# EAGLE board DAC STM32 Board v5 - AD5391 (EAGLE 9.5.2), part 1 of 2
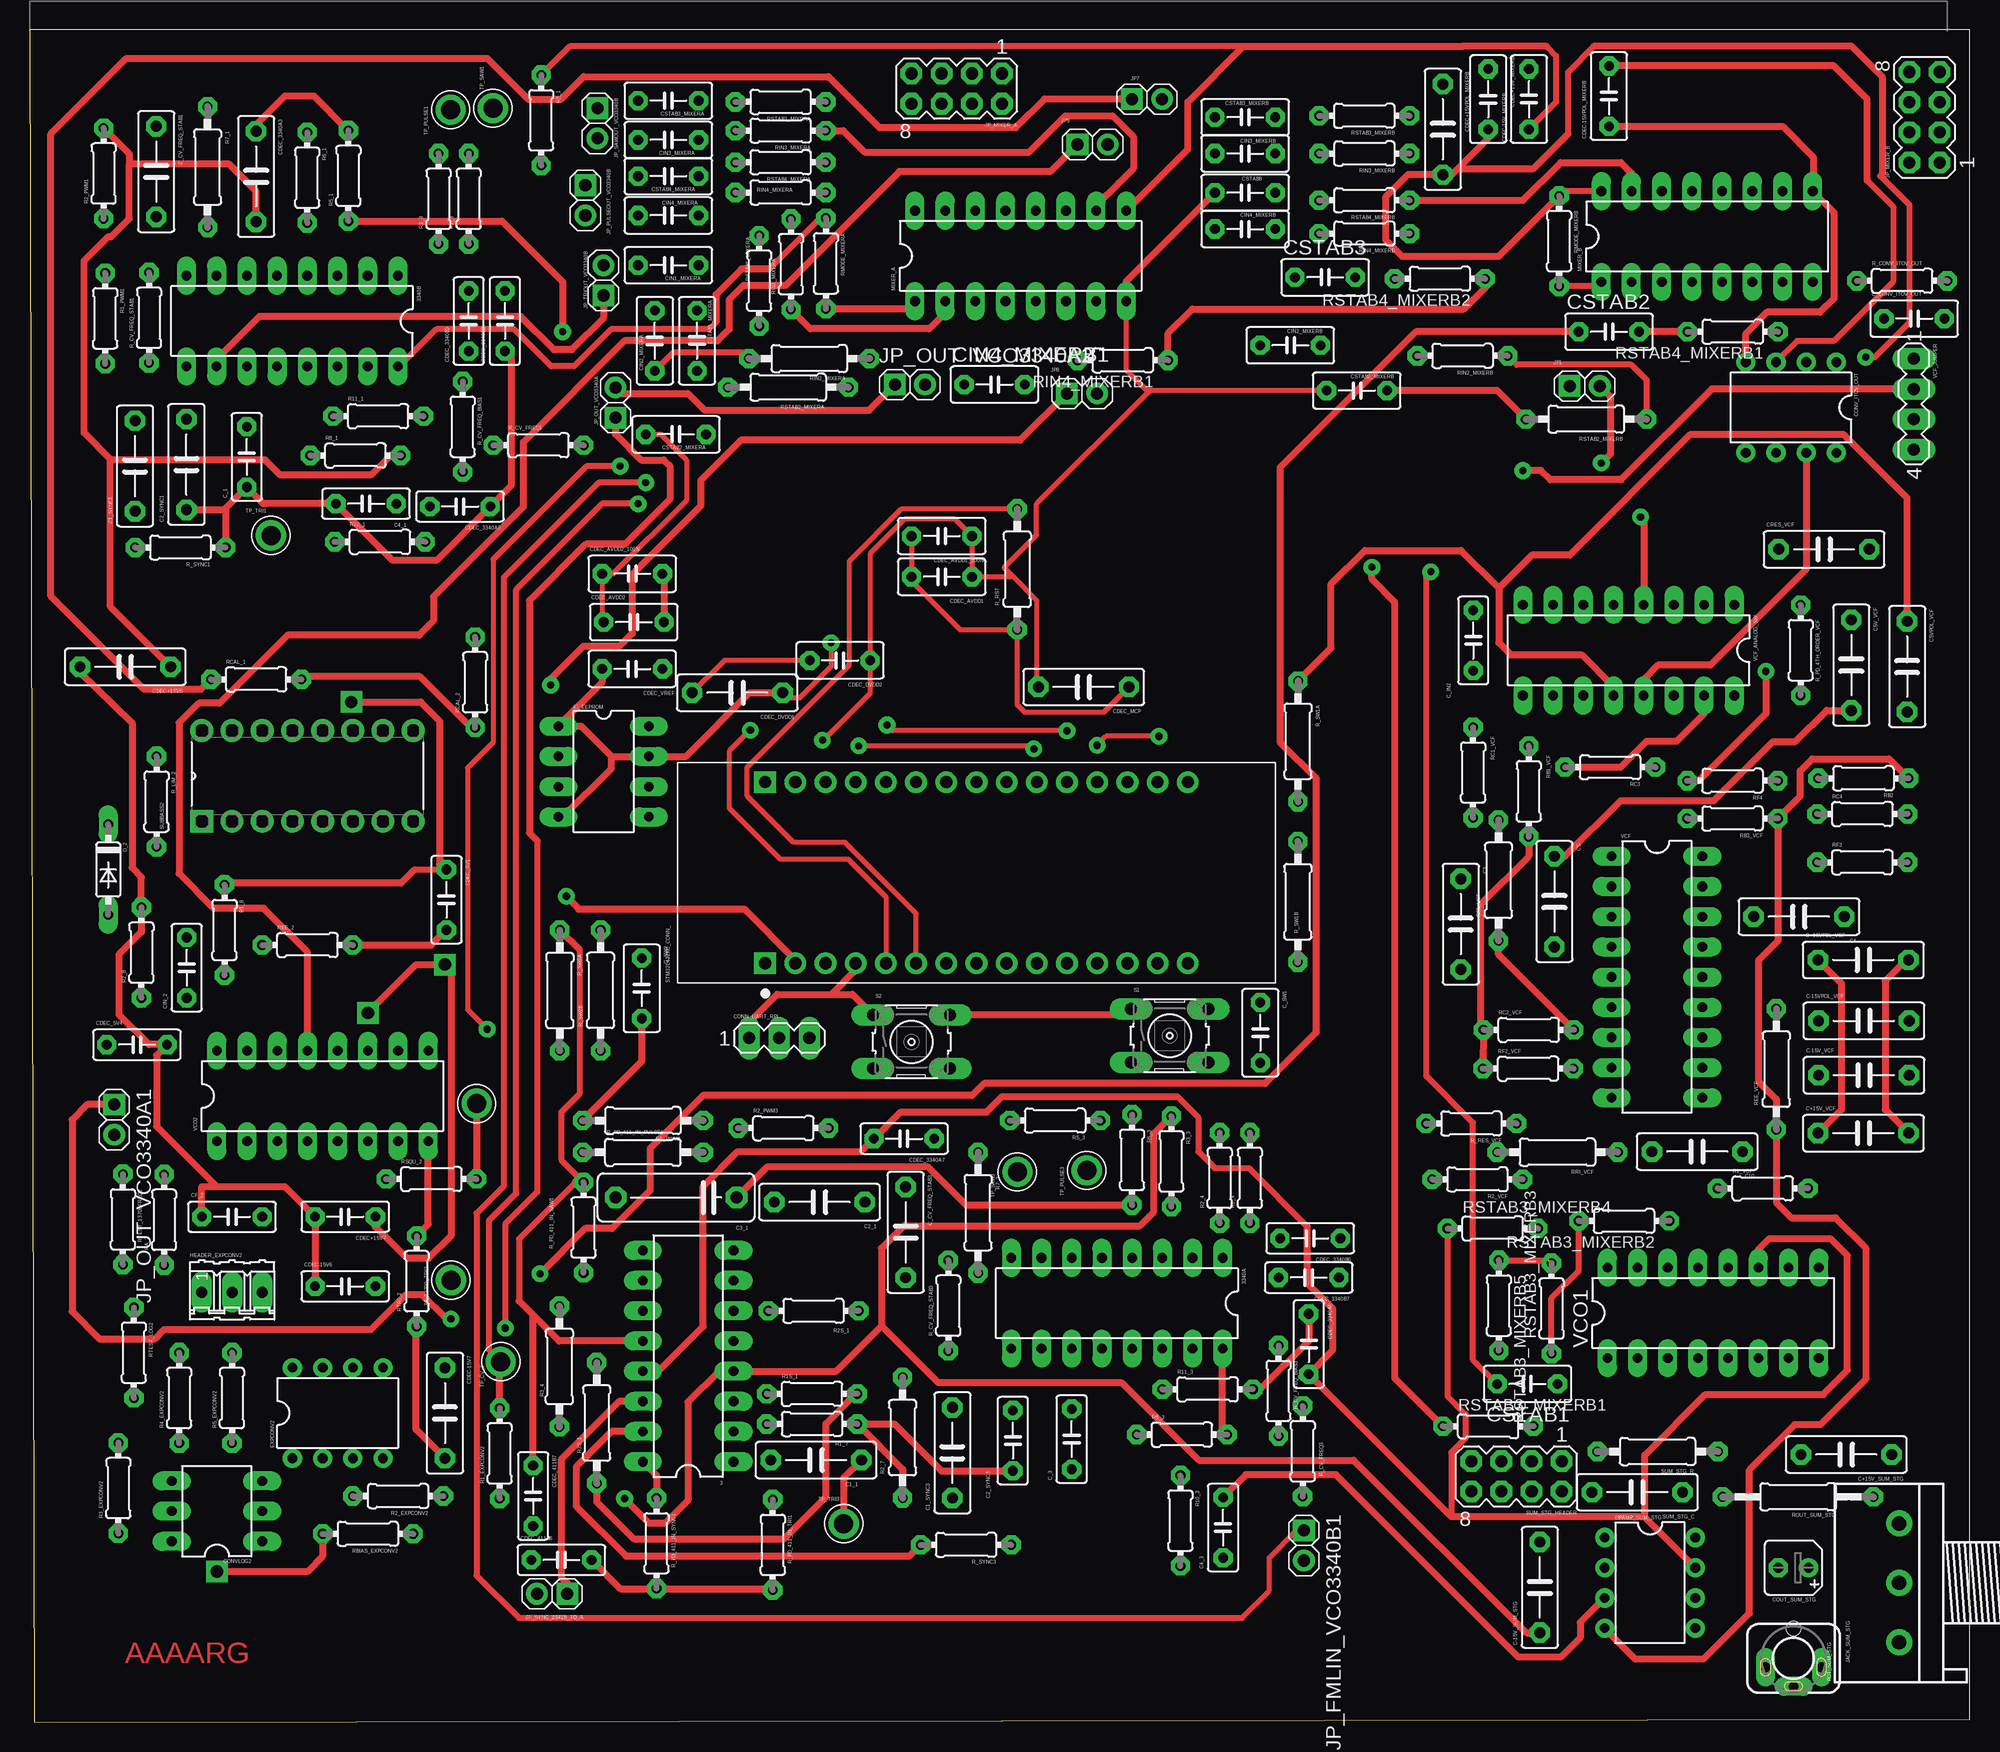
[diagram p6: board, top side]
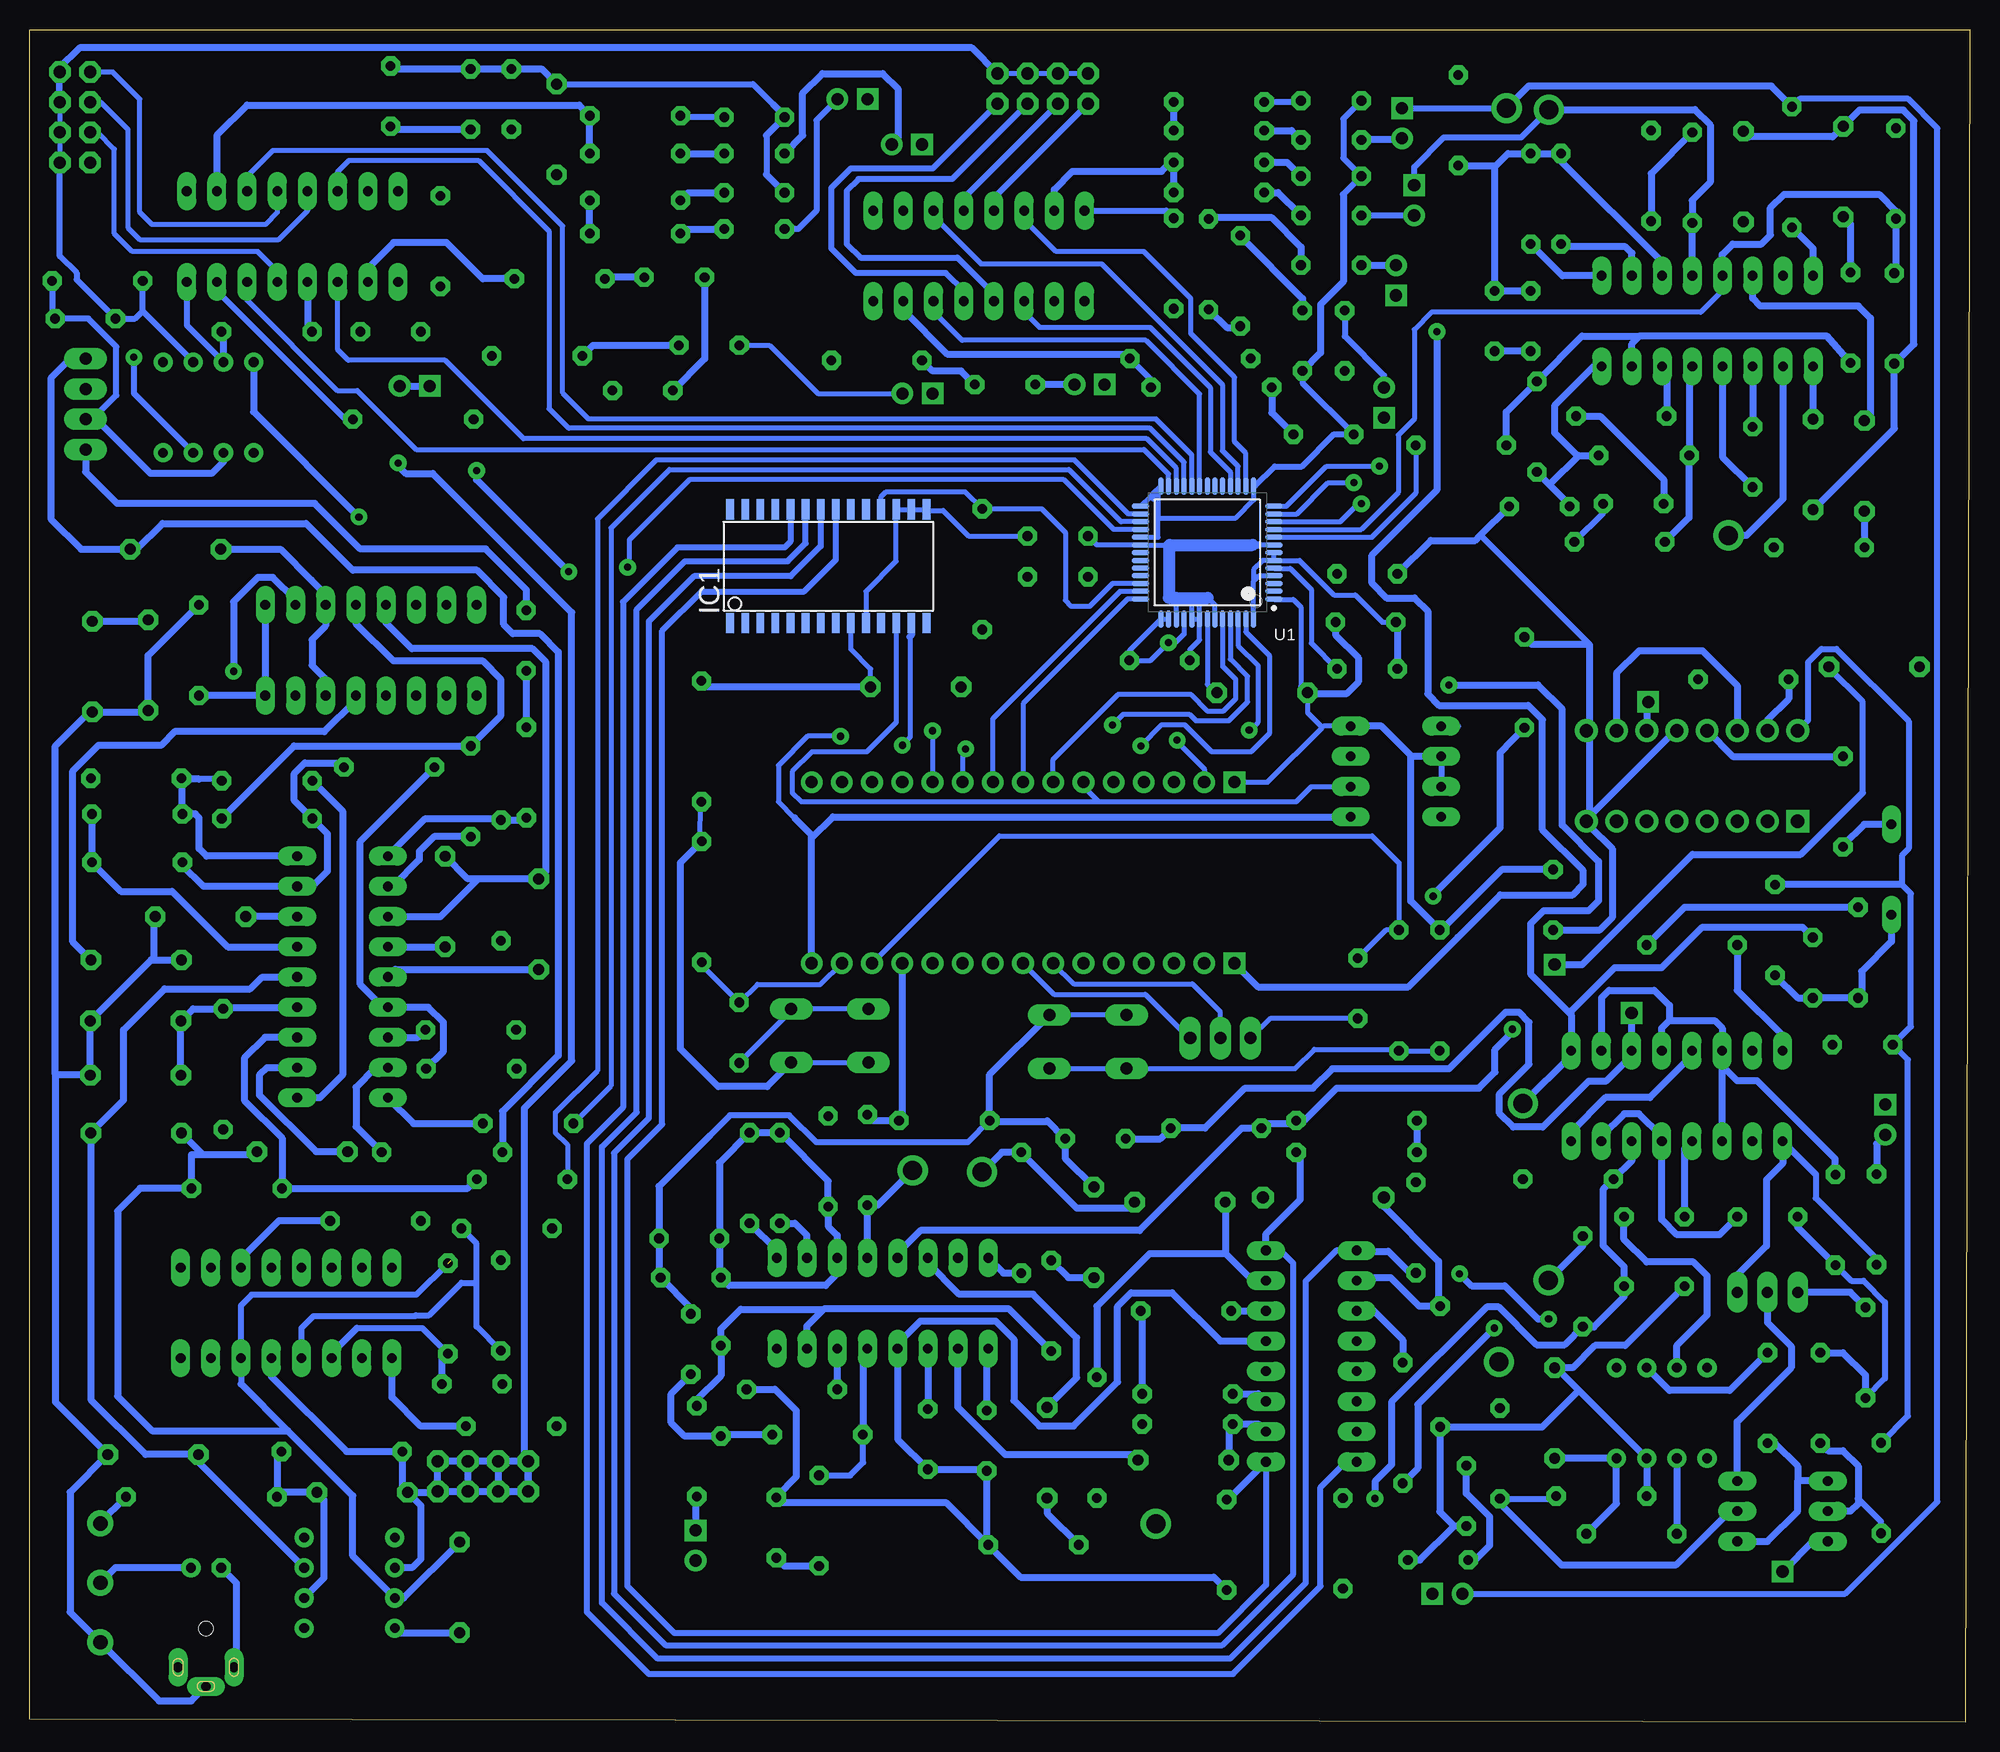
[diagram p7: board, bottom side, seen from below]

Size 163.19 x 142.37 mm. Coordinates in mm from the lower left corner, seen from the top.
Outline: 0.38,0 163.19,0.25 163.19,142.37 0,142.37 0.38,0
Copper layers (1*16): Top 0.035mm / dielectric 1.5mm / Bottom 0.035mm
Design rules "ENSEA_2019": minimum track width 0.4mm, minimum drill 0.6mm, track to track 0.4mm, track to pad 0.4mm, pad to pad 0.4mm, via to via 0.4mm, smd to smd 0.4mm, copper to edge 1mm, drill to drill 0.4mm, minimum pad ring 0.4mm, minimum via ring 0.4mm, stop-mask expansion 4mil, vias tented up to drill 0mil, thermal gap 0.4mm

## Footprints (pad centres in the part's own frame; a part is rotated, then mirrored left to right if it is on the bottom)
DIL16 = drill 0.813 long: 1 -8.89,-3.81; 2 -6.35,-3.81; 3 -3.81,-3.81; 4 -1.27,-3.81; 5 1.27,-3.81; 6 3.81,-3.81; 7 6.35,-3.81; 8 8.89,-3.81; 9 8.89,3.81; 10 6.35,3.81; 11 3.81,3.81; 12 1.27,3.81; 13 -1.27,3.81; 14 -3.81,3.81; 15 -6.35,3.81; 16 -8.89,3.81
C075-032X103 = drill 0.914 octagon: 1 -3.81,0; 2 3.81,0
C050-025X075 = drill 0.813 octagon: 1 -2.54,0; 2 2.54,0
C102-043X133 = drill 1.016 octagon: 1 -5.08,0; 2 5.08,0
C050-030X075 = drill 0.813 octagon: 1 -2.54,0; 2 2.54,0
MA03-1 = drill 1.016 long: 1 -2.54,0; 2 0,0; 3 2.54,0
DIL08 = drill 0.813 pad 1.27: 1 -3.81,-3.81; 2 -1.27,-3.81; 3 1.27,-3.81; 4 3.81,-3.81; 5 3.81,3.81; 6 1.27,3.81; 7 -1.27,3.81; 8 -3.81,3.81
DIL06 = drill 0.813 long: 1 -2.54,-3.81; 2 0,-3.81; 3 2.54,-3.81; 4 2.54,3.81; 5 0,3.81; 6 -2.54,3.81
B45181A = drill 0.813 pad 1.6: + -1.27,0 | drill 0.813 pad 1.6 octagon: - 1.27,0
DO35-7 = drill 0.813 long: A 3.81,0; C -3.81,0
03P = drill 0.914 long: 1 -2.54,0; 2 0,0; 3 2.54,0
SO28W = smd 0.65 x 1.7: 1 -7.62,-4.78; 2 -6.35,-4.78; 3 -5.08,-4.78; 4 -3.81,-4.78; 5 -2.54,-4.78; 6 -1.27,-4.78; 7 0,-4.78; 8 1.27,-4.78; 9 2.54,-4.78; 10 3.81,-4.78; 11 5.08,-4.78; 12 6.35,-4.78; 13 7.62,-4.78; 14 8.89,-4.78; 15 8.89,4.78; 16 7.62,4.78; 17 6.35,4.78; 18 5.08,4.78; 19 3.81,4.78; 20 2.54,4.78; 21 1.27,4.78; 22 0,4.78; 23 -1.27,4.78; 24 -2.54,4.78; 25 -3.81,4.78; 26 -5.08,4.78; 27 -6.35,4.78; 28 -7.62,4.78
DIL8 = drill 0.813 long: 1 -3.81,-3.81; 2 -1.27,-3.81; 3 1.27,-3.81; 4 3.81,-3.81; 5 3.81,3.81; 6 1.27,3.81; 7 -1.27,3.81; 8 -3.81,3.81
1502_01 = drill 0.8 pad 1.2 long: 1 0,2.35; 2 -2.35,0.75; 3 2.35,0.75 | hole 1.2: 0,-2.5
HDR2X1 = drill 1.016 square: 1 0,0 | drill 1.016: 2 2.54,0
MA04-2 = drill 1.016 octagon: 1 -3.81,-1.27; 2 -3.81,1.27; 3 -1.27,-1.27; 4 -1.27,1.27; 5 1.27,-1.27; 6 1.27,1.27; 7 3.81,-1.27; 8 3.81,1.27
3RP/1610N = drill 1.2 pad 2.184: 1 -5,0; 2 0,0; 3 5,0
0204/7 = drill 0.813 octagon: 1 -3.81,0; 2 3.81,0
0207/10 = drill 0.813 octagon: 1 -5.08,0; 2 5.08,0
0207/12 = drill 0.813 octagon: 1 -6.35,0; 2 6.35,0
B3F-10XX = drill 1.016 long: 1 -3.251,2.261; 2 3.251,2.261; 3 -3.251,-2.261; 4 3.251,-2.261
MODULE_NUCLEO-F303K8 = drill 1.02 square: 3.1 -7.62,17.78; 4.1 7.62,17.78 | drill 1.02: 3.2 -7.62,15.24; 3.3 -7.62,12.7; 3.4 -7.62,10.16; 3.5 -7.62,7.62; 3.6 -7.62,5.08; 3.7 -7.62,2.54; 3.8 -7.62,0; 3.9 -7.62,-2.54; 3.10 -7.62,-5.08; 3.11 -7.62,-7.62; 3.12 -7.62,-10.16; 3.13 -7.62,-12.7; 3.14 -7.62,-15.24; 3.15 -7.62,-17.78; 4.2 7.62,15.24; 4.3 7.62,12.7; 4.4 7.62,10.16; 4.5 7.62,7.62; 4.6 7.62,5.08; 4.7 7.62,2.54; 4.8 7.62,0; 4.9 7.62,-2.54; 4.10 7.62,-5.08; 4.11 7.62,-7.62; 4.12 7.62,-10.16; 4.13 7.62,-12.7; 4.14 7.62,-15.24; 4.15 7.62,-17.78
DIP254P762X420-16 = drill 1.118 square: 1 -7.62,17.78 | drill 1.118: 2 -7.62,15.24; 3 -7.62,12.7; 4 -7.62,10.16; 5 -7.62,7.62; 6 -7.62,5.08; 7 -7.62,2.54; 8 -7.62,0; 9 0,0; 10 0,2.54; 11 0,5.08; 12 0,7.62; 13 0,10.16; 14 0,12.7; 15 0,15.24; 16 0,17.78
TESTPOINT_63 = drill 1.6 pad 2.54: P$1 0,0
ANALOG_DEVICES_AD5391BSTZ-3_0 = smd 1.45 x 0.45: 1 -5.6,3.9; 2 -5.6,3.25; 3 -5.6,2.6; 4 -5.6,1.95; 5 -5.6,1.3; 6 -5.6,0.65; 7 -5.6,0; 8 -5.6,-0.65; 9 -5.6,-1.3; 10 -5.6,-1.95; 11 -5.6,-2.6; 12 -5.6,-3.25; 13 -5.6,-3.9; 27 5.6,-3.9; 28 5.6,-3.25; 29 5.6,-2.6; 30 5.6,-1.95; 31 5.6,-1.3; 32 5.6,-0.65; 33 5.6,0; 34 5.6,0.65; 35 5.6,1.3; 36 5.6,1.95; 37 5.6,2.6; 38 5.6,3.25; 39 5.6,3.9 | smd 0.45 x 1.45: 14 -3.9,-5.6; 15 -3.25,-5.6; 16 -2.6,-5.6; 17 -1.95,-5.6; 18 -1.3,-5.6; 19 -0.65,-5.6; 20 0,-5.6; 21 0.65,-5.6; 22 1.3,-5.6; 23 1.95,-5.6; 24 2.6,-5.6; 25 3.25,-5.6; 26 3.9,-5.6; 40 3.9,5.6; 41 3.25,5.6; 42 2.6,5.6; 43 1.95,5.6; 44 1.3,5.6; 45 0.65,5.6; 46 0,5.6; 47 -0.65,5.6; 48 -1.3,5.6; 49 -1.95,5.6; 50 -2.6,5.6; 51 -3.25,5.6; 52 -3.9,5.6
DIL18 = drill 0.813 long: 1 -10.16,-3.81; 2 -7.62,-3.81; 3 -5.08,-3.81; 4 -2.54,-3.81; 5 0,-3.81; 6 2.54,-3.81; 7 5.08,-3.81; 8 7.62,-3.81; 9 10.16,-3.81; 10 10.16,3.81; 11 7.62,3.81; 12 5.08,3.81; 13 2.54,3.81; 14 0,3.81; 15 -2.54,3.81; 16 -5.08,3.81; 17 -7.62,3.81; 18 -10.16,3.81
MA04-1 = drill 1.016 long: 1 -3.81,0; 2 -1.27,0; 3 1.27,0; 4 3.81,0

## Placement (x,y rotation side)
3  ADG411N  [DIL16]  55.39,30.79 90 top
3340A  CEM3340  [DIL16]  91.46,35.23 180 top
3340B  CEM3340  [DIL16]  22.07,117.86 180 top
C1_1  470n  [C075-032X103]  66.15,22.04 180 top
C1_SYNC1  1n  [C075-032X103]  8.86,105.67 90 top
C1_SYNC3  1n  [C075-032X103]  77.62,22.66 90 top
C2_1  470n  [C075-032X103]  66.44,43.74 180 top
C2_SYNC1  100n  [C075-032X103]  13.18,105.8 90 top
C2_SYNC3  100n  [C050-025X075]  82.7,23.68 90 top
C3  300p  [C075-032X103]  120.38,67.12 270 top
C3_1  470n  [C102-043X133]  54.38,44.12 180 top
C4  300p  [C075-032X103]  148.83,67.76 180 top
C4_1  10n  [C050-025X075]  28.29,102.49 180 top
C4_3  10n  [C050-025X075]  100.39,16.36 90 top
C5  300p  [C075-032X103]  128.25,69.03 270 top
C5V_VCF  100n  [C075-032X103]  153.23,88.92 270 top
C5VPOL_VCF  100n  [C075-032X103]  157.93,88.79 270 top
C10  300p  [C075-032X103]  140.27,47.99 180 top
C+15V_SUM_STG  100n  [C075-032X103]  152.81,22.51 180 top
C+15V_VCF  100n  [C075-032X103]  154.25,49.55 0 top
C+15VPOL_VCF  1u  [C075-032X103]  154.24,64.12 0 top
C-15V_SUM_STG  100n  [C075-032X103]  127.03,11.33 90 top
C-15V_VCF  100n  [C075-032X103]  154.29,54.42 0 top
C-15VPOL_VCF  1u  [C075-032X103]  154.29,59 0 top
C_1  1n  [C050-025X075]  18.26,106.43 90 top
C_3  1n  [C050-025X075]  87.65,23.8 90 top
C_CONV_ITOV_OUT  1p  [C050-030X075]  158.52,118.07 0 top
C_CV_FREQ_STAB1  10n  [C075-032X103]  10.64,130.43 270 top
C_CV_FREQ_STAB3  10n  [C075-032X103]  73.68,41.2 270 top
C_IN2  470n  [C050-025X075]  121.43,90.99 90 top
C_SW1  100n  [C050-030X075]  103.52,57.99 270 top
C_SW2  100n  [C050-030X075]  51.48,61.73 270 top
CDEC+15V6  100n  [C075-032X103]  8.04,88.77 180 top
CDEC+15V7  100n  [C050-025X075]  26.54,42.51 180 top
CDEC+15V_MIXERB  100n  [C050-030X075]  122.68,136.53 270 top
CDEC+15VPOL_MIXERB  100n  [C075-032X103]  118.87,133.98 270 top
CDEC-15V6  100n  [C050-025X075]  26.54,36.67 0 top
CDEC-15V7  100n  [C075-032X103]  34.92,26 270 top
CDEC-15V_MIXERB  100n  [C050-030X075]  126.11,136.53 90 top
CDEC-15VPOL_MIXERB  100n  [C050-030X075]  132.84,136.78 90 top
CDEC_5V1  100n  [C050-025X075]  35.05,69.18 270 top
CDEC_5V4  100n  [C050-025X075]  9.02,56.99 0 top
CDEC_411B6  100n  [C050-025X075]  44.72,13.64 0 top
CDEC_411B7  10u  [C050-025X075]  42.35,19.03 270 top
CDEC_3340A2  100n  [C050-025X075]  36.2,102.26 180 top
CDEC_3340A3  10u  [C075-032X103]  19.05,130.02 270 top
CDEC_3340A6  100n  [C050-025X075]  107.59,31.81 270 top
CDEC_3340A7  10u  [C050-025X075]  73.55,49.08 180 top
CDEC_3340B2  100n  [C050-025X075]  39.98,117.86 90 top
CDEC_3340B3  10u  [C050-025X075]  36.93,117.86 90 top
CDEC_3340B6  100n  [C050-025X075]  107.72,40.7 180 top
CDEC_3340B7  10u  [C050-025X075]  107.59,37.39 180 top
CDEC_AVDD1  10u  [C050-030X075]  76.72,96.35 180 top
CDEC_AVDD1_100N  100n  [C050-030X075]  76.72,99.78 180 top
CDEC_AVDD2  10u  [C050-030X075]  50.81,92.54 0 top
CDEC_AVDD2_100N  100n  [C050-030X075]  50.68,96.6 0 top
CDEC_DVDD1  100n  [C075-032X103]  59.52,86.59 180 top
CDEC_DVDD2  100n  [C050-030X075]  68.16,89.31 180 top
CDEC_MCP  100n  [C075-032X103]  88.66,87.08 180 top
CDEC_VREF  100n  [C050-030X075]  50.68,88.6 180 top
CF_2  100nF  [C050-025X075]  17.02,42.51 0 top
CIN1_MIXERA  470n  [C050-030X075]  53.72,122.56 0 top
CIN2_MIXERA  470n  [C050-030X075]  52.58,116.2 270 top
CIN2_MIXERB  470n  [C050-030X075]  106.05,115.82 0 top
CIN3_MIXERA  470n  [C050-030X075]  53.72,133.1 0 top
CIN3_MIXERB  470n  [C050-030X075]  102.23,131.95 0 top
CIN4_MIXERA  470n  [C050-030X075]  53.72,126.75 0 top
CIN4_MIXERB  470n  [C050-030X075]  102.23,125.6 0 top
CIN4_MIXERB1  470n  [C050-030X075]  81.15,112.52 0 top
CIN_2  470n  [C050-025X075]  13.21,63.46 90 top
CONN_UART_RPI  [MA03-1]  63.04,57.54 0 top
CONV_ITOV_OUT  NE5534AN  [DIL08]  148.17,110.59 180 top
CONVLOG2  BC857BS  [DIL06]  15.75,17.74 90 top
COUT_SUM_STG  22u  [B45181A]  148.36,12.98 180 top
CRES_VCF  1u  [C075-032X103]  150.94,98.66 0 top
CSTAB1  10u  [C050-030X075]  125.98,28.45 180 top
CSTAB1_MIXERA  560p  [C050-030X075]  56.13,116.2 90 top
CSTAB2  560p  [C050-030X075]  132.84,116.97 0 top
CSTAB2_MIXERA  560p  [C050-030X075]  54.36,108.33 0 top
CSTAB2_MIXERB  560p  [C050-030X075]  111.63,112.01 0 top
CSTAB3  560p  [C050-030X075]  108.97,121.54 0 top
CSTAB3_MIXERA  560p  [C050-030X075]  53.72,136.4 0 top
CSTAB3_MIXERB  560p  [C050-030X075]  102.23,135 0 top
CSTAB4_MIXERA  560p  [C050-030X075]  53.72,130.05 0 top
CSTAB8  560p  [C050-030X075]  102.23,128.65 0 top
D_2  1N4148DO35-7  [DO35-7]  6.6,71.72 270 top
EXPCONV2  TL081  [DIL08]  25.91,26 0 top
HEADER_EXPCONV2  [03P]  17.02,36.16 0 top
IC1  MCP23017SO  [SO28W]  96.66,97.24 0 bottom
IC_EEPROM  24C04AP  [DIL8]  48.27,79.96 270 top
JACK_SUM_STG  1502_01  [1502_01]  148.36,5.36 180 top
JP1  JUMPER  [HDR2X1]  129.54,112.4 0 top
JP7  JUMPER  [HDR2X1]  92.71,136.53 0 top
JP8  JUMPER  [HDR2X1]  87.25,111.76 0 top
JP9  JUMPER  [HDR2X1]  88.14,132.72 0 top
JP_FMLIN_VCO3340B1  JUMPER  [HDR2X1]  107.19,16.13 270 top
JP_MIXER_A  [MA04-2]  77.98,137.41 180 top
JP_MIXER_B  [MA04-2]  159.38,135 90 top
JP_OUT_VCO3340A  JUMPER  [HDR2X1]  49.28,109.73 90 top
JP_OUT_VCO3340A1  JUMPER  [HDR2X1]  7.11,51.94 270 top
JP_OUT_VCO3340A2  JUMPER  [HDR2X1]  72.77,112.52 0 top
JP_PULSEOUT_VCO3340B  JUMPER  [HDR2X1]  46.74,129.29 270 top
JP_SAWOUT_VCO3340B  JUMPER  [HDR2X1]  47.75,135.76 270 top
JP_SYNC_3340B_TO_A  JUMPER  [HDR2X1]  45.21,10.79 180 top
JP_TRIOUT_VCO3340B  JUMPER  [HDR2X1]  48.26,120.02 90 top
MIXER_A  SSM2164_MULTI  [DIL16]  83.35,123.34 0 top
MIXER_B  SSM2164_MULTI  [DIL16]  141.1,124.97 0 top
OPAMP_SUM_STG  NE5534AN  [DIL08]  136.3,11.71 270 top
POT_SUM_STG  100kB  [3RP/1610N]  157.25,11.71 90 top
R1_3  30k  [0204/7]  36.93,128.15 90 top
R1_4  30k  [0204/7]  102.64,45.78 90 top
R1_7  100k  [0204/7]  65.81,25.07 180 top
R1_8  100k  [0204/7]  16.38,66.64 270 top
R1_EXPCONV2  330  [0204/7]  39.53,22.61 90 top
R1_PWM1  68k  [0204/7]  6.34,118.08 270 top
R1_PWM3  68k  [0207/10]  51.58,50.6 180 top
R1_VCF  10k  [0204/7]  145.78,44.9 0 top
R1S_1  1k  [0204/7]  65.81,27.62 0 top
R2_3  5.6k  [0204/7]  34.39,128.15 90 top
R2_4  5.6k  [0204/7]  100.1,45.78 90 top
R2_7  100k  [0207/10]  73.43,23.93 90 top
R2_8  100k  [0204/7]  9.4,64.73 90 top
R2_EXPCONV2  10  [0204/7]  30.99,19.01 180 top
R2_PWM1  330k  [0204/7]  6.22,130.27 90 top
R2_PWM3  330k  [0204/7]  63.39,49.97 0 top
R2_VCF  100k  [0204/7]  121.78,45.66 180 top
R2S_1  1k  [0204/7]  65.93,34.6 180 top
R3_1  820  [0204/7]  43.03,134.75 270 top
R3_3  820  [0204/7]  96.03,47.17 270 top
R3_4  100k  [0207/10]  44.56,29.92 90 top
R3_EXPCONV2  260  [0204/7]  7.46,19.69 90 top
R3S_1  1k  [0207/10]  47.7,25.17 90 top
R4_EXPCONV2  10  [0204/7]  12.57,27.27 90 top
R5_1  10k  [0204/7]  26.8,130.08 90 top
R5_3  10k  [0204/7]  86.25,50.6 180 top
R5_EXPCONV2  110  [0204/7]  17.02,27.27 90 top
R6_1  33k  [0204/7]  23.34,129.93 270 top
R6_3  33k  [0204/7]  92.73,47.3 270 top
R7_1  5.6k  [0207/10]  14.96,130.81 270 top
R7_3  5.6k  [0207/10]  79.78,42.85 270 top
R8_1  1.5M  [0204/7]  27.4,106.56 0 top
R8_3  1.5M  [0204/7]  96.92,24.19 0 top
R10_1  470  [0204/7]  29.46,99.29 0 top
R10_3  470  [0204/7]  96.79,16.95 270 top
R11_1  1.8k  [0204/7]  29.31,109.86 0 top
R11_3  1.8k  [0204/7]  99.08,28 0 top
R_CONV_ITOV_OUT  33K  [0204/7]  157.5,121.24 0 top
R_CV_FREQ1  68k  [0204/7]  42.79,107.41 0 top
R_CV_FREQ3  68k  [0204/7]  107.08,22.79 270 top
R_CV_FREQ_BIAS1  270k  [0204/7]  36.42,108.97 270 top
R_CV_FREQ_BIAS3  270k  [0204/7]  105.05,27.87 270 top
R_CV_FREQ_STAB1  470  [0204/7]  10.04,118.14 90 top
R_CV_FREQ_STAB3  470  [0204/7]  77.27,35.03 90 top
R_LIM_2  1k  [0204/7]  10.67,77.43 270 top
R_PD_4TH_ORDER_VCF  100k  [0204/7]  148.97,90.17 270 top
R_PD_411_IN_PULSE1  100k  [0207/10]  51.58,47.93 0 top
R_PD_411_IN_SAW1  100k  [0204/7]  46.59,41.6 90 top
R_PD_411_IN_SYNC1  100k  [0204/7]  52.73,15.04 270 top
R_PD_411_IN_TRI1  100k  [0204/7]  62.5,14.91 270 top
R_RES_VCF  100k  [0204/7]  121.27,50.36 180 top
R_RST  10k  [0207/10]  83.07,96.98 90 top
R_SW1A  10k  [0207/10]  106.69,82.5 270 top
R_SW1B  10k  [0207/10]  106.67,69.01 270 top
R_SW2A  10k  [0207/10]  44.59,61.55 270 top
R_SW2B  10k  [0207/10]  48.02,61.55 90 top
R_SYNC1  470k  [0204/7]  12.67,98.81 180 top
R_SYNC3  470k  [0204/7]  78.76,14.91 180 top
RA_2  4.7k  [0204/7]  11.3,42.25 90 top
RB1_VCF  220k  [0204/7]  126.09,78.3 270 top
RB2  220k  [0204/7]  154.25,79.39 180 top
RB3_VCF  220k  [0204/7]  143.24,76.01 180 top
RBIAS_EXPCONV2  47k  [0204/7]  28.45,15.84 180 top
RC1_VCF  91k  [0204/7]  121.41,79.88 270 top
RC2_VCF  91k  [0204/7]  126.09,58.23 0 top
RC3  91k  [0204/7]  132.95,80.33 180 top
RC4  91k  [0204/7]  154.16,76.39 0 top
RCAL_1  47k  [0204/7]  19.05,87.72 0 top
RCAL_2  100k  [0204/7]  37.46,87.47 90 top
REE_2  27k  [0204/7]  23.37,65.37 0 top
REE_VCF  1.5k  [0207/10]  146.92,54.93 90 top
RF1_VCF  100k  [0207/10]  123.55,70.81 90 top
RF2_VCF  100k  [0204/7]  126.04,54.97 0 top
RF3  100k  [0204/7]  154.16,72.33 0 top
RF4  100k  [0204/7]  143.24,79.19 180 top
RIN1_MIXERA  27k  [0204/7]  64.03,122.64 90 top
RIN2_MIXERA  27k  [0207/10]  65.57,114.7 180 top
RIN2_MIXERB  27k  [0204/7]  120.52,114.94 180 top
RIN3_MIXERA  27k  [0204/7]  63.16,133.88 180 top
RIN3_MIXERB  27k  [0204/7]  112.27,131.95 180 top
RIN4_MIXERA  27k  [0204/7]  63.16,128.67 180 top
RIN4_MIXERB  27k  [0204/7]  112.27,125.22 180 top
RIN4_MIXERB1  27k  [0204/7]  91.95,114.55 180 top
RMODE_MIXERA  8.2k  [0204/7]  66.97,122.7 270 top
RMODE_MIXERB  8.2k  [0204/7]  128.65,124.59 270 top
ROUT_SUM_STG  470  [0207/12]  148.75,18.95 180 top
RRI_VCF  51k  [0207/10]  128.51,47.95 180 top
RSQU_2  10k  [0204/7]  33.78,45.68 0 top
RSTAB1_MIXERA  470  [0204/7]  61.36,121.24 90 top
RSTAB2_MIXERA  470  [0207/10]  63.8,112.29 180 top
RSTAB2_MIXERB  470  [0207/10]  130.94,109.6 180 top
RSTAB3_MIXERA  470  [0204/7]  63.16,136.29 180 top
RSTAB3_MIXERB  470  [0204/7]  112.27,135.13 180 top
RSTAB3_MIXERB1  51k  [0204/7]  122.68,24.89 0 top
RSTAB3_MIXERB2  10k  [0204/7]  134.11,42.16 180 top
RSTAB3_MIXERB3  10k  [0204/7]  128.02,34.8 90 top
RSTAB3_MIXERB4  10k  [0204/7]  123.06,41.53 0 top
RSTAB3_MIXERB5  10k  [0204/7]  123.57,35.05 270 top
RSTAB4_MIXERA  470  [0204/7]  63.16,131.21 180 top
RSTAB4_MIXERB  470  [0204/7]  112.27,128.02 180 top
RSTAB4_MIXERB1  470  [0204/7]  143.26,116.97 180 top
RSTAB4_MIXERB2  470  [0204/7]  118.62,121.41 180 top
RTEST_13700FREQ2  27k  [0204/7]  7.84,42.29 270 top
RTEST_LOG2  1k  [0204/7]  8.76,31.08 270 top
RTRI_2  12k  [0204/7]  32.55,37.08 90 top
S1  [B3F-10XX]  95.89,57.74 0 top
S2  [B3F-10XX]  74.18,57.23 0 top
STM32L432KC_CONN_  NUCLEO-F303K8  [MODULE_NUCLEO-F303K8]  79.64,71.45 90 top
SUBBASS2  HEF4027BP  [DIP254P762X420-16]  32.26,83.4 90 top
SUM_STG_C  560p  [C075-032X103]  135.23,19.33 180 top
SUM_STG_HEADER  [MA04-2]  125.07,20.67 180 top
SUM_STG_R  27k  [0207/10]  136.93,22.76 180 top
TP_13700_SQU2  [TESTPOINT_63]  37.59,52.03 90 top
TP_13700_TRI2  [TESTPOINT_63]  35.43,37.17 90 top
TP_CV_2  [TESTPOINT_63]  39.62,30.32 90 top
TP_PULSE1  [TESTPOINT_63]  35.41,135.64 90 top
TP_PULSE3  [TESTPOINT_63]  88.92,46.41 90 top
TP_SAW1  [TESTPOINT_63]  38.96,135.77 90 top
TP_SAW3  [TESTPOINT_63]  83.08,46.28 90 top
TP_TRI1  [TESTPOINT_63]  20.29,99.83 0 top
TP_TRI3  [TESTPOINT_63]  68.47,16.69 0 top
U1  ANALOG_DEVICES_AD5391BSTZ-3ANALOG_DEVICES_AD5391BSTZ-3_0_0  [ANALOG_DEVICES_AD5391BSTZ-3_0]  64.14,98.38 180 bottom
VCF  AS3320  [DIL18]  136.89,62.68 270 top
VCF_ANALOG_SW  DG413DJN  [DIL16]  134.49,90.17 180 top
VCF_JUMPER  [MA04-1]  158.5,110.87 270 top
VCO1  LM13700N  [DIL16]  141.6,34.42 0 top
VCO2  LM13700N  [DIL16]  24.64,52.67 0 top